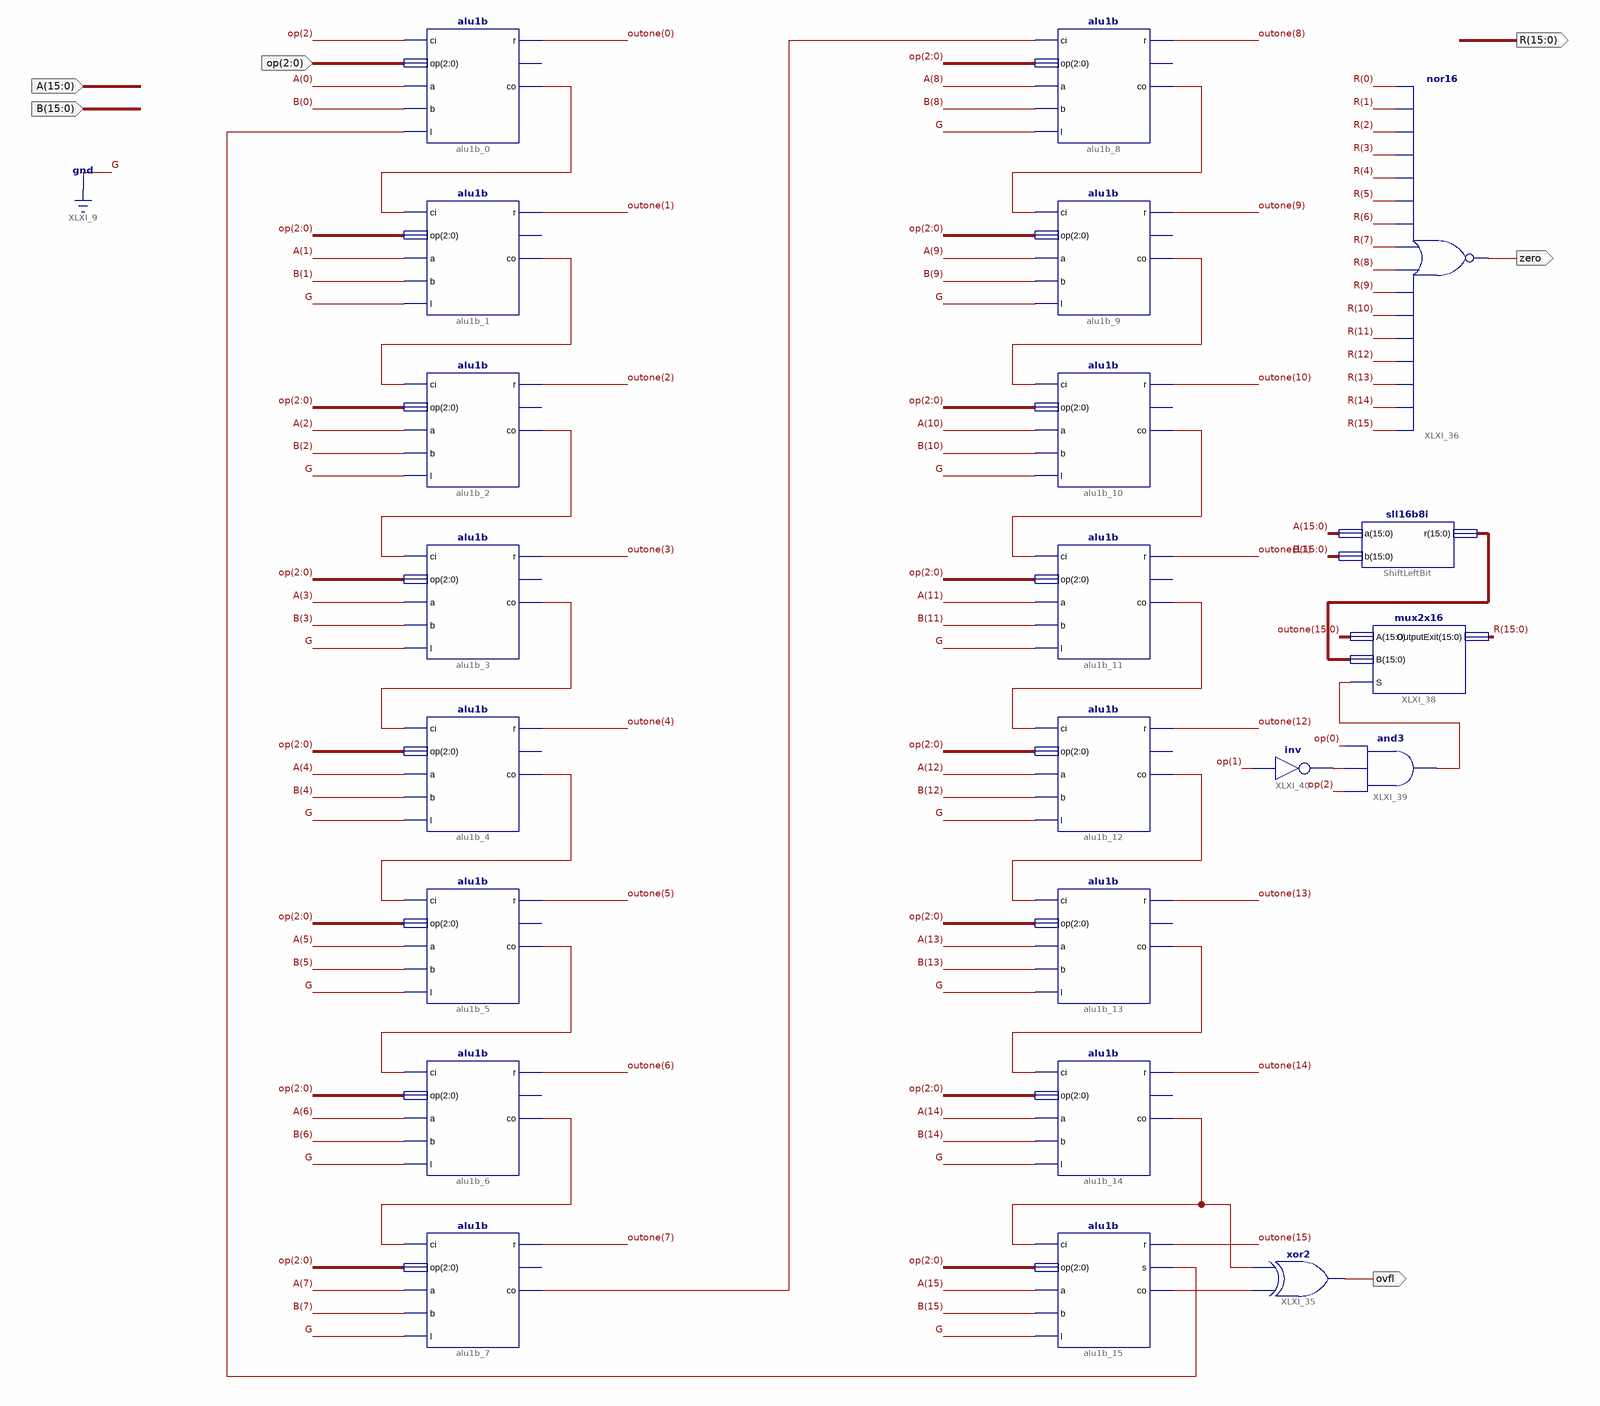
[diagram p0: schematic sheet 1]
// Xilinx ISE schematic alu16b.sch (spartan3e) as structural Verilog: 22 symbols, 7 ports
module alu16b (
  input  [2:0] op,
  input  [15:0] B,
  input  [15:0] A,
  output [15:0] R,
  output ovfl,
  output zero
);

  wire XLXN_1, XLXN_2, XLXN_3, XLXN_6, XLXN_8, XLXN_10, XLXN_63, XLXN_65, XLXN_67, XLXN_89, XLXN_91, XLXN_93,
       XLXN_174, XLXN_175, XLXN_176, XLXN_177, XLXN_181, XLXN_187, XLXN_190;
  wire [15:0] outone, XLXN_184;

  alu1b alu1b_0 (.a(A[0]), .ci(op[2]), .l(XLXN_177), .op(op), .b(B[0]), .co(XLXN_1), .r(outone[0]));  // open: s
  alu1b alu1b_1 (.a(A[1]), .ci(XLXN_1), .l(1'b0), .op(op), .b(B[1]), .co(XLXN_2), .r(outone[1]));  // open: s
  alu1b alu1b_2 (.a(A[2]), .ci(XLXN_2), .l(1'b0), .op(op), .b(B[2]), .co(XLXN_3), .r(outone[2]));  // open: s
  alu1b alu1b_3 (.a(A[3]), .ci(XLXN_3), .l(1'b0), .op(op), .b(B[3]), .co(XLXN_175), .r(outone[3]));  // open: s
  alu1b alu1b_4 (.a(A[4]), .ci(XLXN_175), .l(1'b0), .op(op), .b(B[4]), .co(XLXN_6), .r(outone[4]));  // open: s
  alu1b alu1b_5 (.a(A[5]), .ci(XLXN_6), .l(1'b0), .op(op), .b(B[5]), .co(XLXN_8), .r(outone[5]));  // open: s
  alu1b alu1b_6 (.a(A[6]), .ci(XLXN_8), .l(1'b0), .op(op), .b(B[6]), .co(XLXN_10), .r(outone[6]));  // open: s
  alu1b alu1b_7 (.a(A[7]), .ci(XLXN_10), .l(1'b0), .op(op), .b(B[7]), .co(XLXN_176), .r(outone[7]));  // open: s
  alu1b alu1b_8 (.a(A[8]), .ci(XLXN_176), .l(1'b0), .op(op), .b(B[8]), .co(XLXN_63), .r(outone[8]));  // open: s
  alu1b alu1b_9 (.a(A[9]), .ci(XLXN_63), .l(1'b0), .op(op), .b(B[9]), .co(XLXN_65), .r(outone[9]));  // open: s
  alu1b alu1b_10 (.a(A[10]), .ci(XLXN_65), .l(1'b0), .op(op), .b(B[10]), .co(XLXN_67), .r(outone[10]));  // open: s
  alu1b alu1b_11 (.a(A[11]), .ci(XLXN_67), .l(1'b0), .op(op), .b(B[11]), .co(XLXN_174), .r(outone[11]));  // open: s
  alu1b alu1b_12 (.a(A[12]), .ci(XLXN_174), .l(1'b0), .op(op), .b(B[12]), .co(XLXN_89), .r(outone[12]));  // open: s
  alu1b alu1b_13 (.a(A[13]), .ci(XLXN_89), .l(1'b0), .op(op), .b(B[13]), .co(XLXN_91), .r(outone[13]));  // open: s
  alu1b alu1b_14 (.a(A[14]), .ci(XLXN_91), .l(1'b0), .op(op), .b(B[14]), .co(XLXN_93), .r(outone[14]));  // open: s
  alu1b alu1b_15 (.a(A[15]), .ci(XLXN_93), .l(1'b0), .op(op), .b(B[15]), .s(XLXN_177), .co(XLXN_181), .r(outone[15]));
  xor XLXI_35 (ovfl, XLXN_181, XLXN_93);
  nor XLXI_36 (zero, R[15], R[14], R[13], R[12], R[11], R[10], R[9], R[8], R[7], R[6], R[5], R[4], R[3], R[2], R[1], R[0]);
  sll16b8i ShiftLeftBit (.a(A), .b(B), .r(XLXN_184));
  mux2x16 XLXI_38 (.A(outone), .B(XLXN_184), .S(XLXN_187), .OutputExit(R));
  and XLXI_39 (XLXN_187, op[2], XLXN_190, op[0]);
  not XLXI_40 (XLXN_190, op[1]);
endmodule
